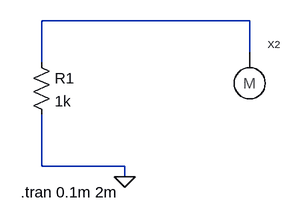
[diagram p0: schematic MotorExample.asc]
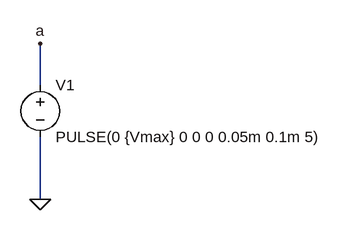
[diagram p1: sub-circuit motor.asc]
MotorExample.asc, the LTspice schematic file:
Version 4
SHEET 1 880 680
WIRE 336 80 16 80
WIRE 336 128 336 80
WIRE 16 144 16 80
WIRE 16 304 16 224
WIRE 144 304 16 304
WIRE 144 320 144 304
FLAG 144 320 0
SYMBOL res 0 128 R0
SYMATTR InstName R1
SYMATTR Value 1k
SYMBOL motor 336 176 R0
SYMATTR InstName X2
TEXT -16 344 Left 2 !.tran 0.1m 2m

motor.asc, the sub-circuit schematic file:
Version 4
SHEET 1 1172 692
WIRE 160 128 160 64
WIRE 160 304 160 208
FLAG 160 64 a
FLAG 160 304 0
SYMBOL voltage 160 112 R0
SYMATTR InstName V1
SYMATTR Value PULSE(0 {Vmax} 0 0 0 0.05m 0.1m 5)

The netlist it stands for:
* MotorExample.asc
R1 N001 0 1k
XX2 N001 motor params: Vmax=5

* block symbol definitions
.subckt motor a
V1 a 0 PULSE(0 {Vmax} 0 0 0 0.05m 0.1m 5)
.ends motor

.tran 0.1m 2m
.backanno
.end